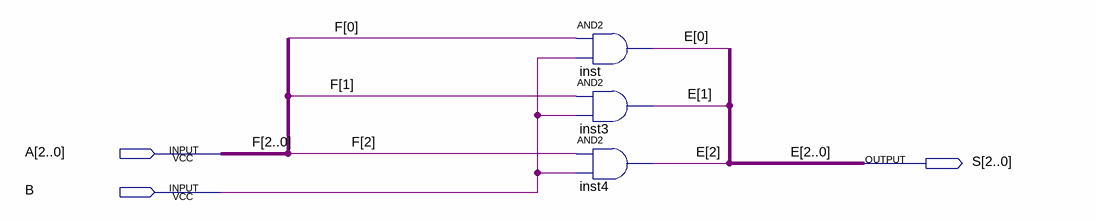
[diagram p0: schematic sheet]
// Quartus schematic mu_3bit.bdf as structural Verilog: 3 symbols, 3 pins
module mu_3bit (
  input  [2:0] A,
  input  B,
  output [2:0] S
);

  and inst (S[0], A[0], B);
  and inst3 (S[1], A[1], B);
  and inst4 (S[2], A[2], B);

  // Other names for the same wires on the sheet: E[2:0] = S; F[2:0] = A
endmodule
